# EAGLE schematic 2 (1) (EAGLE 7.5.0)

## Sheet 1 of 2

## Sheet 2 of 2
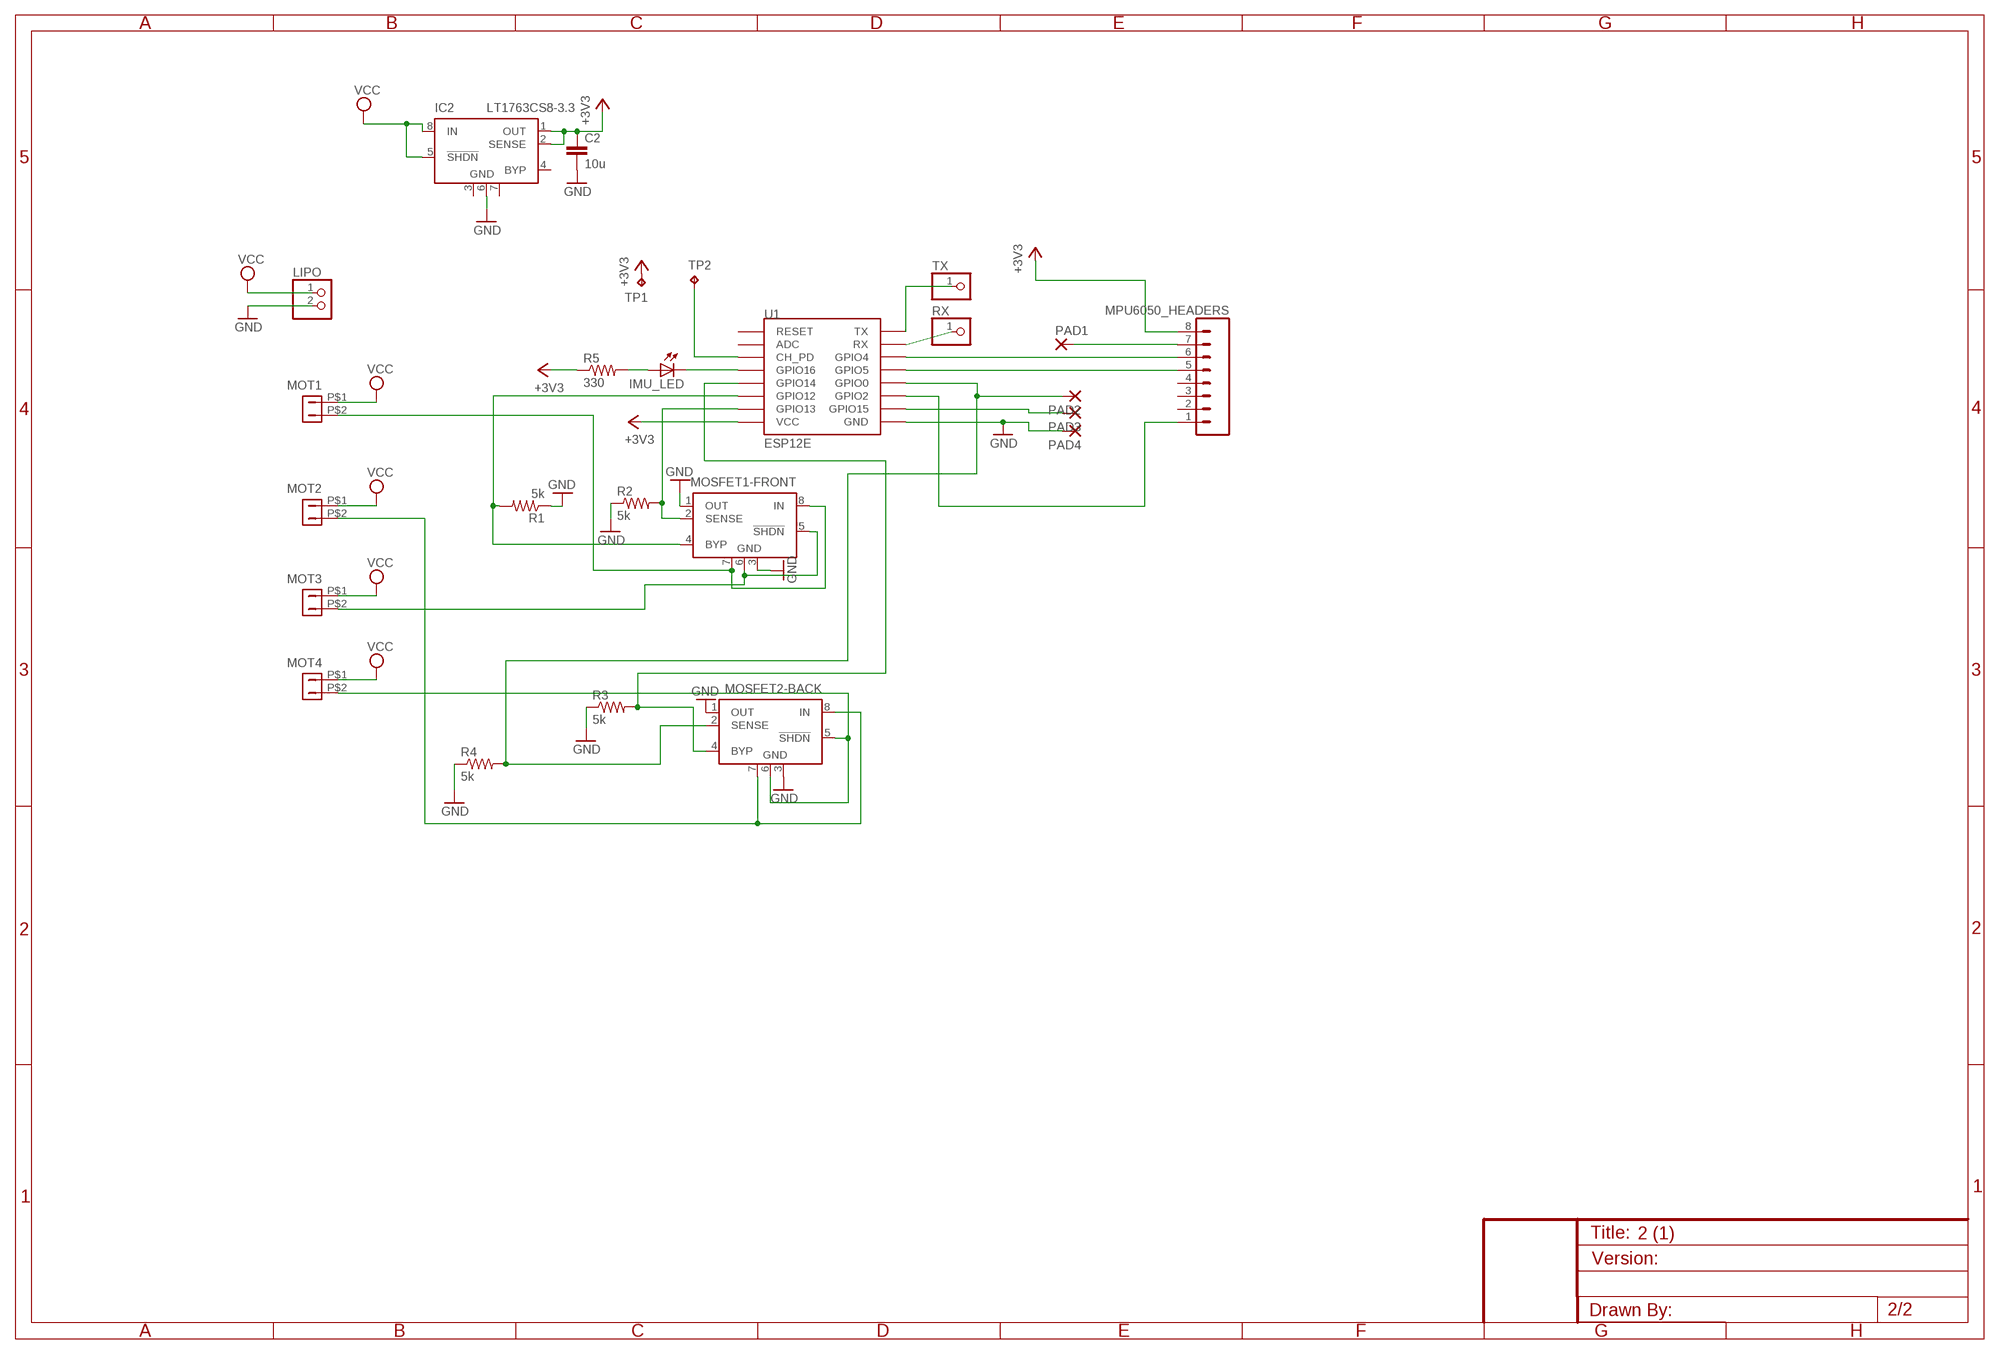
[diagram p0: schematic, sheet 2]

### Parts
C2  10u  C-EUC0603K  [C0603K]
IC2  LT1763CS8-3.3  [SOIC8]
IMU_LED  LEDCHIPLED_0805  [CHIPLED_0805]
LIPO  PINHD-1X2  [1X02]
MOSFET1-FRONT  LT1763CS8-1.5  [SOIC8]
MOSFET2-BACK  LT1763CS8-1.5  [SOIC8]
MOT1  DF13-2P-1.25DSA  [DF13-2P-1.25DSA]
MOT2  DF13-2P-1.25DSA  [DF13-2P-1.25DSA]
MOT3  DF13-2P-1.25DSA  [DF13-2P-1.25DSA]
MOT4  DF13-2P-1.25DSA  [DF13-2P-1.25DSA]
MPU6050_HEADERS  M08  [08P]
PAD1  SMD2  [SMD1,27-2,54]
PAD2  SMD2  [SMD1,27-2,54]
PAD3  SMD2  [SMD1,27-2,54]
PAD4  SMD2  [SMD1,27-2,54]
R1  5k  R-US_R0402  [R0402]
R2  5k  R-US_R0402  [R0402]
R3  5k  R-US_R0402  [R0402]
R4  5k  R-US_R0402  [R0402]
R5  330  R-US_R0402  [R0402]
RX  PINHD-1X1  [1X01]
TP1  TPTP12SQ  [TP12SQ]
TP2  TPTP12SQ  [TP12SQ]
TX  PINHD-1X1  [1X01]
U1  ESP12E  ESP12SMD  [ESP12-SMD]

### Nets
+3V3: C2.1 IC2.1(OUT) IC2.2(SENSE) MPU6050_HEADERS.8 R5.1 TP1.TP U1.VCC
GND: C2.2 IC2.6(GND) LIPO.2 MOSFET1-FRONT.1(OUT) MOSFET1-FRONT.3(GND) MOSFET2-BACK.1(OUT) MOSFET2-BACK.3(GND) PAD4.1(P) R1.1 R2.1 R3.1 R4.1 U1.GND
GPIO10_ESP: MPU6050_HEADERS.7 PAD1.1(P)
N$1: IMU_LED.C U1.GPIO16
N$2: TP2.TP U1.CH_PD
N$3: MPU6050_HEADERS.6 U1.GPIO4
N$4: MPU6050_HEADERS.5 U1.GPIO5
N$5: MOSFET2-BACK.2(SENSE) PAD2.1(P) R4.2 U1.GPIO0
N$6: MPU6050_HEADERS.1 U1.GPIO2
N$7: PAD3.1(P) U1.GPIO15
N$8: MOSFET2-BACK.7(GND) MOSFET2-BACK.8(IN) MOT2.P$2
N$9: TX.1 U1.TXD0(TX)
N$10: RX.1 U1.RXD0(RX)
N$11: MOSFET1-FRONT.2(SENSE) R2.2 U1.GPIO13
N$12: MOSFET1-FRONT.4(BYP) R1.2 U1.GPIO12
N$13: MOSFET1-FRONT.7(GND) MOSFET1-FRONT.8(IN) MOT1.P$2
N$14: MOSFET2-BACK.4(BYP) R3.2 U1.GPIO14
N$16: MOSFET1-FRONT.5(!SHDN) MOSFET1-FRONT.6(GND) MOT3.P$2
N$18: MOSFET2-BACK.5(!SHDN) MOSFET2-BACK.6(GND) MOT4.P$2
N$22: IMU_LED.A R5.2
VCC: IC2.5(!SHDN) IC2.8(IN) LIPO.1 MOT1.P$1 MOT2.P$1 MOT3.P$1 MOT4.P$1
Unconnected: IC2.4(BYP) MPU6050_HEADERS.2 MPU6050_HEADERS.3 MPU6050_HEADERS.4 U1.ADC U1.RESET

## Power pins joined to a net without a drawn wire
GND: IC2.3(GND) IC2.7(GND)

## Library data of the parts
C2 = rcl:C-EU: CAPACITOR, European symbol
IC2 = linear-technology:LT1763CS8: 500mA, Low Noise, LDO Micropower Regulators Source: http://cds.linear.com/docs/Datasheet/1763ff.pdf; MPN: LT1763CS8-3.3; OC_FARNELL: 1273617; OC_NEWARK: 57M6055
IMU_LED = led:LED: LED OSRAM: - CHIPLED LG R971, LG N971, LY N971, LG Q971, LY Q971, LO R971, LY R971 LH N974, LH R974 LS Q976, LO Q976, LY Q976 LO Q996 - Hyper CHIPLED LW Q18S LB Q993, LB Q99A, LB R99A - SideLED LS A670, LO A670, LY A670, LG A670, LP A670 LB A673, LV A673, LT A673, LW A673 LH A674 LY A675 LS A676, LA A676, LO A676, LY A676, LW A676 LS A679, LY A679, LG A679 - Hyper Micro SIDELED® LS Y876, LA Y876, LO Y876, LY Y876 LT Y87S - SmartLED LW L88C, LW L88S LB L89C, LB L89S, LG L890 LS L89K, LO L89K, LY L89K LS L896, LA L896, LO L896, LY L896 - TOPLED LS T670, LO T670, LY T670, LG T670, LP T670 LSG T670, LSP T670, LSY T670, LOP T670, LYG T670 LG T671, LOG T671, LSG T671 LB T673, LV T673, LT T673, LW T673 LH T674 LS T676, LA T676, LO T676, LY T676, LB T676, LH T676, LSB T676, LW T676 LB T67C, LV T67C, LT T67C, LS T67K, LO T67K, LY T67K, LW E67C LS E67B, LA E67B, LO E67B, LY E67B, LB E67C, LV E67C, LT E67C LW T67C LS T679, LY T679, LG T679 LS T770, LO T770, LY T770, LG T770, LP T770 LB T773, LV T773, LT T773, LW T773 LH T774 LS E675, LA E675, LY E675, LS T675 LS T776, LA T776, LO T776, LY T776, LB T776 LHGB T686 LT T68C, LB T68C - Hyper Mini TOPLED® LB M676 - Mini TOPLED Santana® LG M470 LS M47K, LO M47K, LY M47K Source: http://www.osram.convergy.de LUXEON: - LUMILED® LXK2-PW12-R00, LXK2-PW12-S00, LXK2-PW14-U00, LXK2-PW14-V00 LXK2-PM12-R00, LXK2-PM12-S00, LXK2-PM14-U00 LXK2-PE12-Q00, LXK2-PE12-R00, LXK2-PE12-S00, LXK2-PE14-T00, LXK2-PE14-U00 LXK2-PB12-K00, LXK2-PB12-L00, LXK2-PB12-M00, LXK2-PB14-N00, LXK2-PB14-P00, LXK2-PB14-Q00 LXK2-PR12-L00, LXK2-PR12-M00, LXK2-PR14-Q00, LXK2-PR14-R00 LXK2-PD12-Q00, LXK2-PD12-R00, LXK2-PD12-S00 LXK2-PH12-R00, LXK2-PH12-S00 LXK2-PL12-P00, LXK2-PL12-Q00, LXK2-PL12-R00 Source: www.luxeon.com KINGBRIGHT: KA-3528ASYC Source: www.kingbright.com
LIPO = pinhead:PINHD-1X2: PIN HEADER
MOSFET1-FRONT MOSFET2-BACK = linear-technology:LT1763CS8: 500mA, Low Noise, LDO Micropower Regulators Source: http://cds.linear.com/docs/Datasheet/1763ff.pdf; MPN: LT1763CS8-1.5; OC_FARNELL: 1501016; OC_NEWARK: 57M6043
MOT1-MOT4 = con-hirose-df13:DF13-2P-1.25: DF13-2P 1.25mm Pitch Miniature Crimping Connector.
MPU6050_HEADERS = con-amp-quick:M08: AMP QUICK CONNECTOR; OC_FARNELL: unknown; OC_NEWARK: unknown
PAD1-PAD4 = wirepad:SMD2: SMD PAD
R1-R5 = resistor:R-US_: RESISTOR, American symbol
RX TX = pinhead:PINHD-1X1: PIN HEADER
TP1 TP2 = testpad:TP: Test pad
U1 = esp8266:ESP12: ESP8266 Wifi module 12